# Altium schematic sheet outputs.SchDoc
size A4
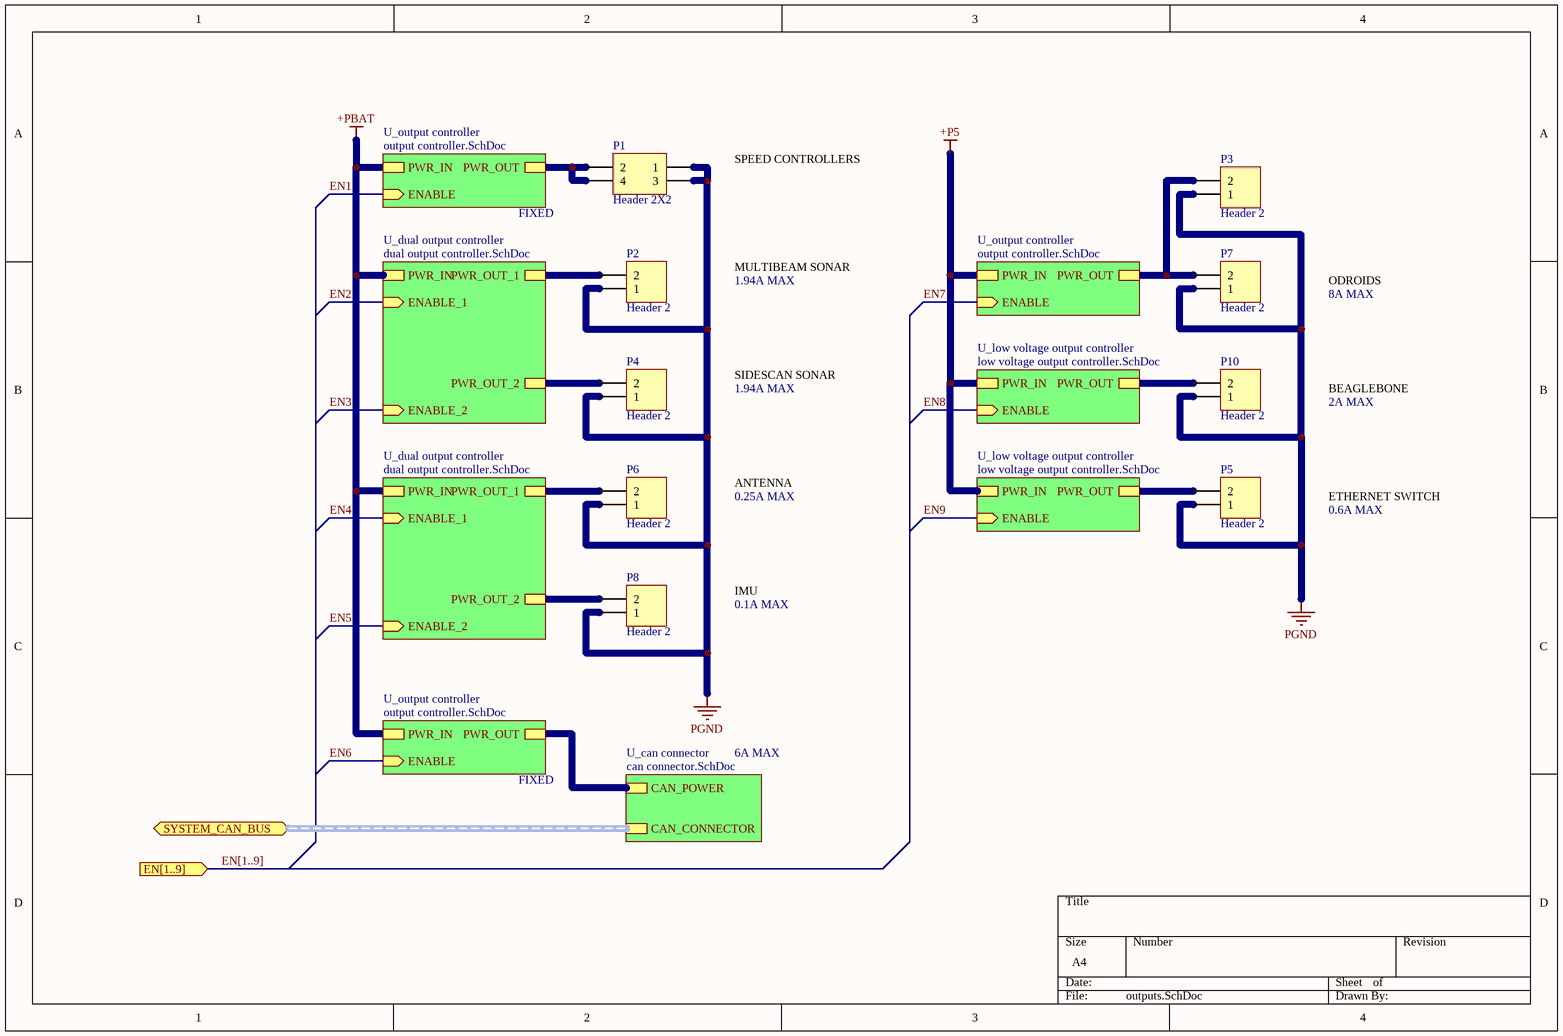
[diagram p0: outputs.SchDoc]

## Parts
P1  Header 2X2  [39-28-1043]
P2  Header 2  [39-28-1023]
P3  Header 2  [43045-0212]
P4  Header 2  [39-28-1023]
P5  Header 2  [43045-0212]
P6  Header 2  [39-28-1023]
P7  Header 2  [43045-0212]
P8  Header 2  [39-28-1023]
P10  Header 2  [43045-0212]

## Sub-sheets
U_can connector = can connector.SchDoc: CAN_CONNECTOR (harness CAN), CAN_POWER
U_dual output controller = dual output controller.SchDoc: ENABLE_1 (in), ENABLE_2 (in), PWR_OUT_1, PWR_OUT_2, PWR_IN
U_dual output controller = dual output controller.SchDoc: ENABLE_1 (in), ENABLE_2 (in), PWR_OUT_1, PWR_OUT_2, PWR_IN
U_low voltage output controller = low voltage output controller.SchDoc: PWR_IN, PWR_OUT, ENABLE (in)
U_low voltage output controller = low voltage output controller.SchDoc: PWR_IN, PWR_OUT, ENABLE (in)
U_output controller = output controller.SchDoc: PWR_IN, PWR_OUT, ENABLE (in)
U_output controller = output controller.SchDoc: PWR_IN, PWR_OUT, ENABLE (in)
U_output controller = output controller.SchDoc: PWR_IN, PWR_OUT, ENABLE (in)

## Ports
EN[1..9] (in), SYSTEM_CAN_BUS (harness CAN)

## Nets
+P5: sheet U_output controller/PWR_IN, sheet U_low voltage output controller/PWR_IN, sheet U_low voltage output controller/PWR_IN
+PBAT: sheet U_output controller/PWR_IN, sheet U_output controller/PWR_IN, sheet U_dual output controller/PWR_IN, sheet U_dual output controller/PWR_IN
PGND: P1.1 P1.3 P2.1 P3.1 P4.1 P5.1 P6.1 P7.1 P8.1 P10.1
EN1: sheet U_output controller/ENABLE
EN2: sheet U_dual output controller/ENABLE_1
EN3: sheet U_dual output controller/ENABLE_2
EN4: sheet U_dual output controller/ENABLE_1
EN5: sheet U_dual output controller/ENABLE_2
EN6: sheet U_output controller/ENABLE
EN7: sheet U_output controller/ENABLE
EN8: sheet U_low voltage output controller/ENABLE
EN9: sheet U_low voltage output controller/ENABLE
NetP1_2: P1.2 P1.4 ; sheet U_output controller/PWR_OUT
NetP2_2: P2.2 ; sheet U_dual output controller/PWR_OUT_1
NetP3_2: P3.2 P7.2 ; sheet U_output controller/PWR_OUT
NetP4_2: P4.2 ; sheet U_dual output controller/PWR_OUT_2
NetP5_2: P5.2 ; sheet U_low voltage output controller/PWR_OUT
NetP6_2: P6.2 ; sheet U_dual output controller/PWR_OUT_1
NetP8_2: P8.2 ; sheet U_dual output controller/PWR_OUT_2
NetP10_2: P10.2 ; sheet U_low voltage output controller/PWR_OUT
(unnamed): sheet U_can connector/CAN_POWER, sheet U_output controller/PWR_OUT

## Buses and harness runs
bus EN[1..9] = port EN[1..9]
harness port SYSTEM_CAN_BUS = sheet U_can connector/CAN_CONNECTOR

## Notes on the sheet
- SPEED CONTROLLERS
- FIXED
- MULTIBEAM SONAR
- 1.94A MAX
- ODROIDS
- 8A MAX
- SIDESCAN SONAR
- BEAGLEBONE
- 2A MAX
- ANTENNA
- 0.25A MAX
- ETHERNET SWITCH
- 0.6A MAX
- IMU
- 0.1A MAX
- 6A MAX

## Library data of the parts
P1 = Header 2X2: Header, 2-Pin, Dual row; LatestRevisionDate: 17-Jul-2002; LatestRevisionNote: Re-released for DXP Platform.; Publisher: Altium Limited; farnell: 9732098
P2-P8 P10 = Header 2: Header, 2-Pin; LatestRevisionDate: 17-Jul-2002; LatestRevisionNote: Re-released for DXP Platform.; Publisher: Altium Limited
  P2 P4 P6 P8: farnell: 9732080
  P3 P5 P7 P10: farnell: 9733000